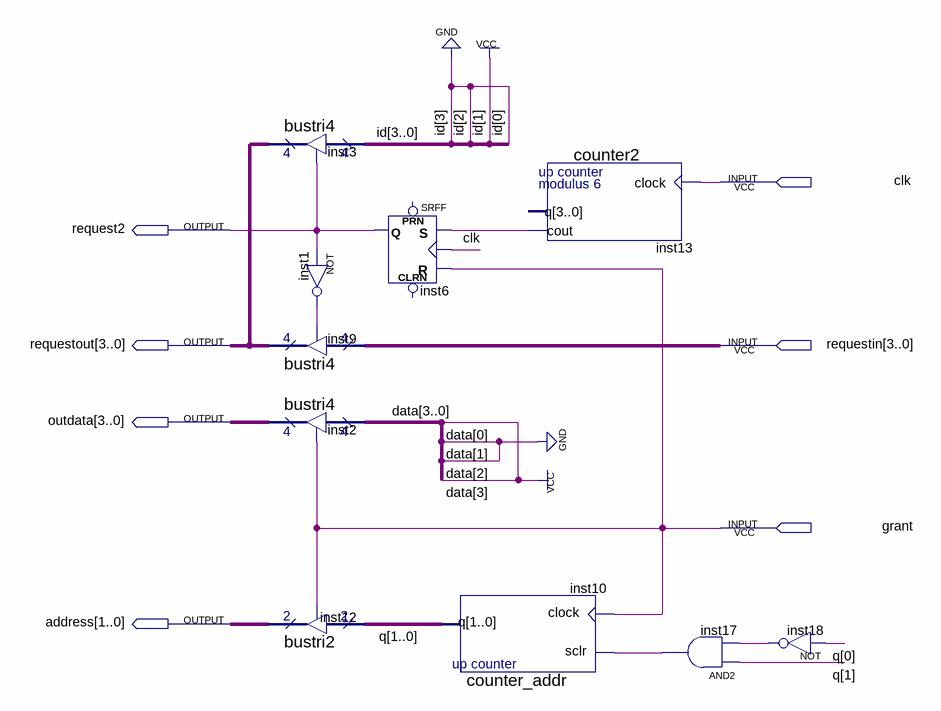
[diagram p0: schematic sheet]
// Quartus schematic master2.bdf as structural Verilog: 10 symbols, 7 pins
module master2 (
  input  clk,
  input  [3:0] requestin,
  input  grant,
  output request2,
  output [3:0] requestout,
  output [3:0] outdata,
  output [1:0] address
);

  wire inst1_out, inst13_cout, inst17_out, inst18_out;
  wire [1:0] q;

  bustri4 inst3 (.enabledt(request2), .data(4'b0010), .tridata(requestout));
  bustri4 inst9 (.enabledt(inst1_out), .data(requestin), .tridata(requestout));
  bustri4 inst2 (.enabledt(grant), .data(4'b1001), .tridata(outdata));
  bustri2 inst12 (.enabledt(grant), .data(q), .tridata(address));
  not inst1 (inst1_out, request2);
  SRFF inst6 (.S(inst13_cout), .R(grant), .CLK(clk), .Q(request2));  // open: PRN, CLRN
  counter_addr inst10 (.sclr(inst17_out), .clock(grant), .q(q));
  counter2 inst13 (.clock(clk), .cout(inst13_cout));  // open: q
  and inst17 (inst17_out, q[1], inst18_out);
  not inst18 (inst18_out, q[0]);
endmodule
